# EAGLE design CH549_typeC_Power_Delivery (EAGLE 9.6.2)
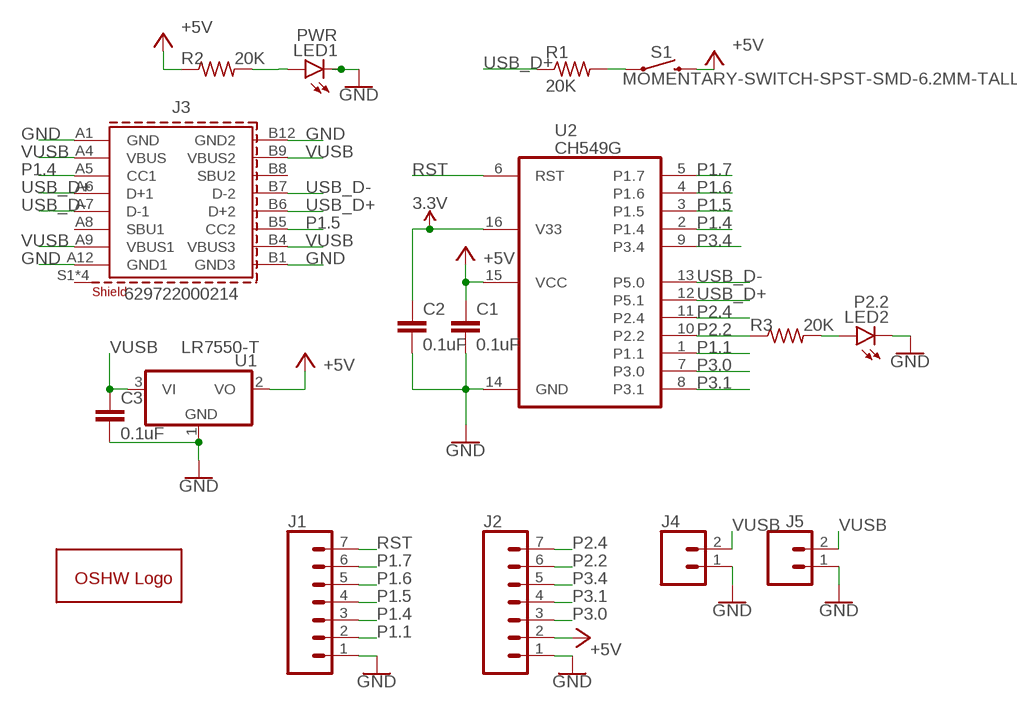
[diagram p0: schematic, sheet 1]

## Parts
C1  0.1uF  C-EUC0805K  [C0805K]
C2  0.1uF  C-EUC0805K  [C0805K]
C3  0.1uF  C-EUC0805K  [C0805K]
GOLD_ORB_SM1  OSHWLOGOLOGO8MM  [OSHW_8MM]
J1  CONN_07NO_SILK  [1X07_NO_SILK]
J2  CONN_07NO_SILK  [1X07_NO_SILK]
J3  629722000214  [629722000214]
J4  CONN_021X02_NO_SILK  [1X02_NO_SILK]
J5  CONN_021X02_NO_SILK  [1X02_NO_SILK]
LED1  PWR  GHI-BASICCOMPONENTS_LED-(INCH)-0805  [GHI-BASICCOMPONENTS_0805-LED]
LED2  P2.2  GHI-BASICCOMPONENTS_LED-(INCH)-0805  [GHI-BASICCOMPONENTS_0805-LED]
R1  20K  R-US_R0805  [R0805]
R2  20K  R-US_R0805  [R0805]
R3  20K  R-US_R0805  [R0805]
S1  MOMENTARY-SWITCH-SPST-SMD-6.2MM-TALL  [TACTILE_SWITCH_SMD_6.2MM_TALL]
U1  MCP1703CB  [SOT23]
U2  CH549G  MY_IC_CH549GSOP-16  [MY_IC_SO16]

## Nets
3.3V: C2.1 U2.16(V33)
+5V: C1.1 J2.2 R2.1 S1.B2 U1.2(VO) U2.15(VCC)
GND: C1.2 C2.2 C3.2 J1.1 J2.1 J3.A1(GND) J3.A12(GND1) J3.B1(GND3) J3.B12(GND2) J4.1 J5.1 LED1.K LED2.K U1.1(GND) U2.14(GND)
N$1: R1.2 S1.A2
N$2: LED2.A R3.2
N$3: LED1.A R2.2
P1.1: J1.2 U2.1(P1.1)
P1.4: J1.3 J3.A5(CC1) U2.2(P1.4)
P1.5: J1.4 J3.B5(CC2) U2.3(P1.5)
P1.6: J1.5 U2.4(P1.6)
P1.7: J1.6 U2.5(P1.7)
P2.2: J2.6 R3.1 U2.10(P2.2)
P2.4: J2.7 U2.11(P2.4)
P3.0: J2.3 U2.7(P3.0)
P3.1: J2.4 U2.8(P3.1)
P3.4: J2.5 U2.9(P3.4)
RST: J1.7 U2.6(RST)
USB_D+: J3.A6(D+1) J3.B6(D+2) R1.1 U2.12(P5.1)
USB_D-: J3.A7(D-1) J3.B7(D-2) U2.13(P5.0)
VUSB: C3.1 J3.A4(VBUS) J3.A9(VBUS1) J3.B4(VBUS3) J3.B9(VBUS2) J4.2 J5.2 U1.3(VI)
Unconnected: J3.A8(SBU1) J3.B8(SBU2) J3.S1(SHIELD) J3.S2(SHIELD) J3.S3(SHIELD) J3.S4(SHIELD)

## Library data of the parts
C1-C3 = rcl:C-EU: CAPACITOR, European symbol; LCSC: C16834; SPICEPREFIX: C
GOLD_ORB_SM1 = oshw:OSHWLOGO: The OSHW logo for PCB layout
J1 J2 = SparkFun-Connectors:CONN_07: Multi connection point. Often used as Generic Header-pin footprint for 0.1 inch spaced/style header connections On any of the 0.1 inch spaced packages, you can populate with these: Break Away Headers - Straight <https://www.sparkfun.com/products/116> (PRT-00116) Break Away Male Headers - Right Angle <https://www.sparkfun.com/products/553> (PRT-00553) Female Headers <https://www.sparkfun.com/products/115> (PRT-00115) Break Away Headers - Machine Pin <https://www.sparkfun.com/products/117> (PRT-00117) Break Away Female Headers - Swiss Machine Pin <https://www.sparkfun.com/products/743> (PRT-00743) For SCREWTERMINALS and SPRING TERMINALS visit here: Screw Terimnals on SparkFun.com <https://www.sparkfun.com/search/results?term=Screw+Terminals> (5mm/3.5mm/2.54mm spacing) This device is also useful as a general connection point to wire up your design to another part of your project. Our various solder wires solder well into these plated through hole pads. Hook-Up Wire - Assortment (Stranded, 22 AWG) <https://www.sparkfun.com/products/11375> (PRT-11375) Hook-Up Wire - Assortment (Solid Core, 22 AWG) <https://www.sparkfun.com/products/11367> (PRT-11367) View the entire wire category on our website here <https://www.sparkfun.com/categories/141> Special notes: Molex polarized connector foot print use with SKU : PRT-08231 with associated crimp pins and housings. 1MM SMD Version SKU: PRT-10208 NOTES ON THE VARIANTS LOCK and LOCK_LONGPADS... This footprint was designed to help hold the alignment of a through-hole component (i.e. 6-pin header) while soldering it into place. You may notice that each hole has been shifted either up or down by 0.005 of an inch from it's more standard position (which is a perfectly straight line). This slight alteration caused the pins (the squares in the middle) to touch the edges of the holes. Because they are alternating, it causes a "brace" to hold the component in place. 0.005 has proven to be the perfect amount of "off-center" position when using our standard breakaway headers. Although looks a little odd when you look at the bare footprint, once you have a header in there, the alteration is very hard to notice. Also,if you push a header all the way into place, it is covered up entirely on the bottom side.
J3 = Wurth_Connectors_WR-USB:629722000214: WR-COM USB 2.0 Type C Receptacle Horizontal SMT Kind Properties Durability 10 000 Mating cycles Gender Receptacle Type Horizontal General Information Operating Temperature -40 up to +85 °C Electrical Properties Working Voltage 20 V (DC) Withstanding Voltage 100 V (AC) Contact Resistance 40 mΩ Material Properties Insulator Material LCP Insulator Flammability Rating UL94 V-0 Insulator Color Black Contact Material Brass Contact Plating Gold over Nickel Contact Type Stamped Shielding Material Steel Shielding Plating Nickel (Ni) <https://www.we-online.com/components/media/o689297v209%20family-wr-com-629722000214.jpg> Details see: www.we-online.com/en/components/products/WR-COM_USB_20_TYPE_C_RECEPTACLE_HORIZONTAL_SMT <www.we-online.com/catalog/WR-COM_USB_20_TYPE_C_RECEPTACLE_HORIZONTAL_SMT/?utm_source=eagle_model&utm_medium=description_link&utm_campaign=eisos_eagle> Updated by Ella Wu 2023-05-30 2023 (C) Würth Elektronik; APPLICATION: USB 2.0; DATASHEET-URL: https://www.we-online.com/redexpert/spec/629722000214?ae; GERDER: Receptacle; INTERFACE-TYPE: Type C; IR: 5A; LCSC: C165948 C2765186; MOUNT: SMT; PACKAGING: Tape and Reel; PART-NUMBER: 629722000214; PINS: 16; TYPE: Horizontal; WORKING-VOLTAGE: 20V(AC)
J4 J5 = SparkFun-Connectors:CONN_02: Multi connection point. Often used as Generic Header-pin footprint for 0.1 inch spaced/style header connections On any of the 0.1 inch spaced packages, you can populate with these: Break Away Headers - Straight <https://www.sparkfun.com/products/116> (PRT-00116) Break Away Male Headers - Right Angle <https://www.sparkfun.com/products/553> (PRT-00553) Female Headers <https://www.sparkfun.com/products/115> (PRT-00115) Break Away Headers - Machine Pin <https://www.sparkfun.com/products/117> (PRT-00117) Break Away Female Headers - Swiss Machine Pin <https://www.sparkfun.com/products/743> (PRT-00743) For SCREWTERMINALS and SPRING TERMINALS visit here: Screw Terimnals on SparkFun.com <https://www.sparkfun.com/search/results?term=Screw+Terminals> (5mm/3.5mm/2.54mm spacing) This device is also useful as a general connection point to wire up your design to another part of your project. Our various solder wires solder well into these plated through hole pads. Hook-Up Wire - Assortment (Stranded, 22 AWG) <https://www.sparkfun.com/products/11375> (PRT-11375) Hook-Up Wire - Assortment (Solid Core, 22 AWG) <https://www.sparkfun.com/products/11367> (PRT-11367) View the entire wire category on our website here <https://www.sparkfun.com/categories/141> Special notes: Molex polarized connector foot print use with: PRT-08233 with associated crimp pins and housings. 2.54_SCREWTERM for use with PRT-10571. 3.5mm Screw Terminal footprints for PRT-08084 5mm Screw Terminal footprints for use with PRT-08432
LED1 LED2 = BeagleBone_Black_Wireless:GHI-BASICCOMPONENTS_LED-(INCH)-
R1-R3 = rcl:R-US_: RESISTOR, American symbol; SPICEPREFIX: R
S1 = SparkFun-Switches:MOMENTARY-SWITCH-SPST: Momentary Switch (Pushbutton) - SPST Normally-open (NO) SPST momentary switches (buttons, pushbuttons). Variants PTH-12MM - 12mm square, through-hole Momentary Pushbutton Switch - 12mm Square <https://www.sparkfun.com/products/9190> (COM-09190) PTH-6.0MM, PTH-6.0MM-KIT - 6.0mm square, through-hole Mini Pushbutton Switch <https://www.sparkfun.com/products/97> (COM-00097) KIT package intended for soldering kit's - only one side of pads' copper is exposed. PTH-RIGHT-ANGLE-KIT - Right-angle, through-hole Right Angle Tactile Button <https://www.sparkfun.com/products/10791> - Used on SparkFun BigTime Watch Kit <https://www.sparkfun.com/products/11734> SMD-12MM - 12mm square, surface-mount Tactile Button - SMD (12mm) <https://www.sparkfun.com/products/12993> (COM-12993) Used on SparkFun PicoBoard <https://www.sparkfun.com/products/11888> SMD-4.5MM - 4.5mm Square Trackball Switch Used on SparkFun Blackberry Trackballer Breakout <https://www.sparkfun.com/products/13169> SMD-4.6MMX2.8MM - 4.60mm x 2.80mm, surface mount Used on SparkFun SAMD21 Mini Breakout <https://www.sparkfun.com/products/13664> SMD-5.2MM, SMD-5.2-REDUNDANT - 5.2mm square, surface-mount Mini Pushbutton Switch - SMD <https://www.sparkfun.com/products/8720> (COM-08720) Used on Arduino Pro Mini <https://www.sparkfun.com/products/11114> REDUNDANT package connects both switch circuits together SMD-6.0X3.5MM - 6.0 x 3.5mm, surface mount Momentary Reset Switch SMD <https://www.sparkfun.com/products/8229> (COM-08229) SMD-6.2MM-TALL - 6.2mm square, surface mount Tactile Button - SMD (6mm) <https://www.sparkfun.com/products/12992> Used on SparkFun Digital Sandbox <https://www.sparkfun.com/products/12651> SMD-RIGHT-ANGLE - Right-angle, surface mount Used on SparkFun Block for Intel® Edison - Arduino <https://www.sparkfun.com/products/13036>; PROD_ID: SWCH-11966; SF_SKU: COM-12992
U1 = linear:MCP1703: 250 mA, 16V, Low Quiescent Current LDO Regulator Source: http://ww1.microchip.com/downloads/en/DeviceDoc/22049b.pdf; ACTUAL_PART: LR7550-T
U2 = myOwnLib:MY_IC_CH549G; LCSC: C111292

## Board
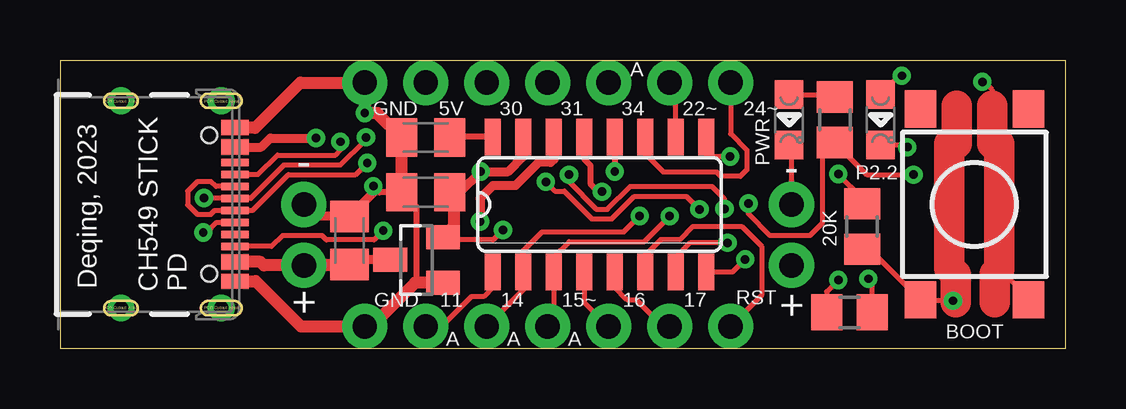
[diagram p1: board, top side]
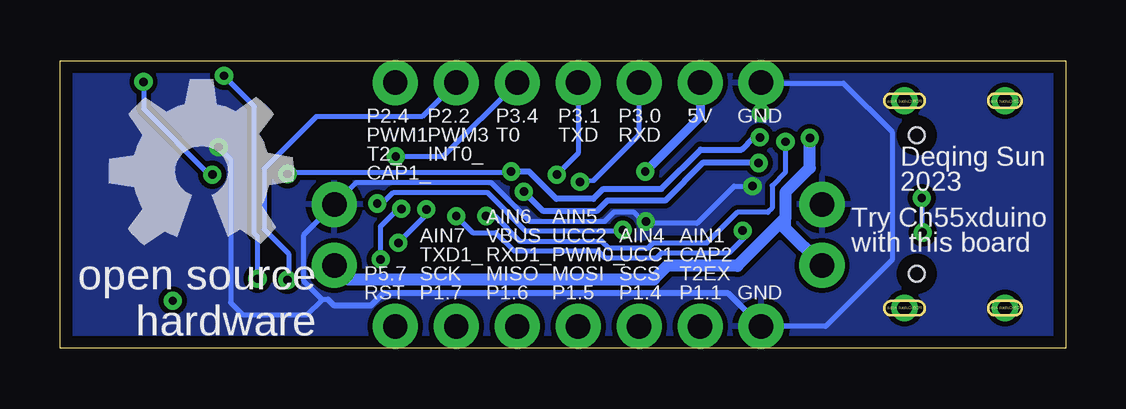
[diagram p2: board, bottom side, seen from below]

Size 41.91 x 11.99 mm. Coordinates in mm from the lower left corner, seen from the top.
Outline: 0,0 41.91,0 41.91,11.99 0,11.99 0,0
Copper layers (1*16): Top 0.035mm / dielectric 1.5mm / Bottom 0.035mm
Design rules "eagleRules10Mil *": minimum track width 8mil, minimum drill 0.3mm, track to track 8mil, track to pad 8mil, pad to pad 8mil, via to via 8mil, smd to smd 8mil, copper to edge 20mil, drill to drill 20mil, minimum pad ring 10mil, minimum via ring 8mil, stop-mask expansion 4mil, vias tented up to drill 14mil, thermal gap 10mil

### Footprints (pad centres in the part's own frame; a part is rotated, then mirrored left to right if it is on the bottom)
C0805K = smd 1.3 x 1.6: 1 -1,0; 2 1,0
1X07_NO_SILK = drill 1.016 pad 1.88: 1 0,0; 2 2.54,0; 3 5.08,0; 4 7.62,0; 5 10.16,0; 6 12.7,0; 7 15.24,0
629722000214 = smd 0.3 x 1.15: A1 -3.35,4.745; A4 -2.55,4.745; A5 -1.25,4.745; A6 -0.25,4.745; A7 0.25,4.745; A8 1.25,4.745; A9 2.55,4.745; A12 3.35,4.745; B1 3.05,4.745; B4 2.25,4.745; B5 1.75,4.745; B6 0.75,4.745; B7 -0.75,4.745; B8 -1.75,4.745; B9 -2.25,4.745; B12 -3.05,4.745 | drill 0.6 pad 1: S1 -4.32,4.18; S2 4.32,4.18; S3 -4.32,0; S4 4.32,0 | hole 0.65: -2.89,3.68; 2.89,3.68
1X02_NO_SILK = drill 1.016 pad 1.88: 1 0,0; 2 2.54,0
GHI-BASICCOMPONENTS_0805-LED = smd 1.2 x 1.2: A 0,1.05; K 0,-1.05
R0805 = smd 1.3 x 1.5: 1 -0.95,0; 2 0.95,0
TACTILE_SWITCH_SMD_6.2MM_TALL = smd 1.55 x 1.3: A1 -3.975,-2.25; A2 3.975,-2.25; B1 -3.975,2.25; B2 3.975,2.25
SOT23 = smd 1 x 1.4: 1 -0.95,-1.1; 2 0.95,-1.1; 3 0,1.1
MY_IC_SO16 = smd 0.66 x 1.524: 1 -4.445,-2.819; 2 -3.175,-2.819; 3 -1.905,-2.819; 4 -0.635,-2.819; 5 0.635,-2.819; 6 1.905,-2.819; 7 3.175,-2.819; 8 4.445,-2.819; 9 4.445,2.819; 10 3.175,2.819; 11 1.905,2.819; 12 0.635,2.819; 13 -0.635,2.819; 14 -1.905,2.819; 15 -3.175,2.819; 16 -4.445,2.819

### Placement (x,y rotation side)
C1  15.24,6.5 180 top
C2  15.24,8.79 180 top
C3  12.06,4.5 90 top
GOLD_ORB_SM1  36.04,7.37 0 bottom
J1  12.7,0.91 0 top
J2  12.7,11.07 0 top
J3  2.54,5.99 270 top
J4  10.16,5.99 270 top
J5  30.48,5.99 270 top
LED1  30.38,9.53 0 top
LED2  34.19,9.53 0 top
R1  33.43,5.08 270 top
R2  32.28,9.53 90 top
R3  32.89,1.5 0 top
S1  38.1,5.99 270 top
U1  14.86,3.68 90 top
U2  22.48,5.99 0 top

### Tracks (layer width: path | path; a pad name or v marks a point on that pad's centre or on a via)
3.3V
  Top 0.254: U2.16 16.27,8.81 C2.1
+5V  (via drill 0.35)
  Top 0.203: v18.46,4.93 18.05,4.52 16.07,4.52 U1.2 | S1.B2 40.35,2.14 39.14,3.3 39.09,3.35 39.09,3.25 38.94,3.1 | 39.14,8.53 38.84,8.53 | 38.84,10.11 38.84,10.77 38.43,11.18 v38.43,11.1 | v28.69,6.03 28.69,5.6 29.59,4.7 31.24,4.7 31.75,5.21 31.75,8.04 R2.1 33.62,7.24 v35.56,7.24
  Top 0.254: C1.1 16.66,6.5
  Top 0.305: 16.41,6.25 16.26,6.25 | 16,6.5 C1.1
  Top 0.381: 16.41,6.25 16.66,6.5 v17.53,7.37 18.67,7.37 19.3,8 U2.15
  Top 0.508: 16,6.5 16.26,6.25 16.41,6.1 16.41,5.08 U1.2
  Top 1.27: 39.14,8.53 39.14,3.3 | 38.84,10.11 38.84,8.53 | 38.94,3.1 38.94,1.93
  Bottom 0.203: v18.46,4.93 18.52,4.88 22.5,4.88 24.11,6.5 28.02,6.5 28.69,5.83 v28.69,6.03 | v38.43,11.1 38.43,9.98 35.69,7.24 v35.56,7.24
  Bottom 0.381: J2.2 15.24,9.65 v17.53,7.37
GND  (via drill 0.35)
  Top 0.203: 7.16,9.24 7.18,9.24 J3.A1 J3.B12 | 7.44,2.8 J3.A12 J3.B1 | J5.1 30.48,8.37 LED1.K | LED2.K 35.21,8.47 v35.31,8.38
  Top 0.254: v13.06,6.76 13.31,6.5 C1.2 14.86,5.88 14.86,2.79 14.8,2.73
  Top 0.381: v17.5,5.28 17.5,6.25 18.03,6.78 18.97,6.78 19.94,7.75 20.45,7.75 20.57,7.87 U2.14 | J4.1 10.66,5.5 C3.2 13.06,6.49 v13.06,6.76
  Top 0.508: C1.2 C2.2 13.22,9.8 v12.7,9.8 J2.1 10.01,11.07 8.13,9.19 7.21,9.19 7.16,9.24 | U1.1 14.8,2.73 12.98,0.91 J1.1 10.03,0.91 8.15,2.8 7.44,2.8
  Bottom 0.203: 12.7,11.05 9.27,11.05 7.24,9.02 7.24,3.68 10.01,0.91 J1.1 | v13.06,6.76 13.82,6.76 15.37,5.21 17.42,5.21 v17.5,5.28 17.6,5.28 18.01,5.69 18.82,5.69 19.23,5.28 22.33,5.28 23.95,6.9 29.57,6.9 J5.1 31.75,4.72 31.75,2.79 30.99,2.03 | 30.73,2.03 30.99,2.03 | v35.31,8.38 34.8,7.87 34.8,1.91 34.29,1.4 31.62,1.4 30.99,2.03
  Bottom 0.254: J2.1 12.7,11.05 v12.7,9.8 | J1.1 14.07,2.29 28.45,2.29 28.96,1.78 30.48,1.78 30.73,2.03
  pour Bottom: 0,0 41.91,0 41.91,11.99 0,11.99
N$1  (via drill 0.35)
  Top 0.203: 37.06,8.53 37.36,8.53 | 37.06,3.34 37.31,3.08 | 37.31,1.93 37.26,1.98 v37.21,1.98 35.89,1.98 S1.A2 33.74,4.13 R1.2
  Top 1.27: 37.06,8.53 37.06,3.34 | 37.36,8.53 37.36,10.11 | 37.31,1.93 37.31,3.08
N$2  (via drill 0.35)
  Top 0.203: R3.2 33.84,2.74 v33.68,2.9 | LED2.A 34.95,11.34 34.95,11.36 v35.08,11.36
  Bottom 0.203: v33.68,2.9 33.68,4.66 33.81,4.79 33.81,10.09 v35.08,11.36
N$3
  Top 0.203: LED1.A 32.18,10.57 R2.2
P1.1
  Top 0.203: U2.1 18.03,2.54 17.65,2.16 17.14,2.16 15.9,0.91 J1.2
P1.4  (via drill 0.35)
  Top 0.203: J1.3 19.3,2.44 U2.2 19.3,4.06 20.09,4.85 23.49,4.85 v24.15,5.51 | J3.A5 8.25,7.24 9.05,8.05 11.48,8.05 11.68,8.26 v11.68,8.61
  Bottom 0.203: v24.15,5.51 23.8,5.51 22.76,4.47 19.33,4.47 19.05,4.19 17.4,4.19 17.19,4.4 14.96,4.4 13.69,5.67 12.42,5.67 12.24,5.84 12.24,6.78 11.68,7.34 v11.68,8.61
P1.5  (via drill 0.35)
  Top 0.203: J1.4 20.57,1.17 U2.3 20.57,3.81 21.21,4.45 24.34,4.45 v25.4,5.51 | v13.47,4.9 13.09,4.52 11.1,4.52 10.92,4.7 9.27,4.7 8.82,4.24 J3.B5
  Bottom 0.203: v25.4,5.51 24.72,4.83 23.75,4.83 22.99,4.06 19.5,4.06 19.22,3.79 17.04,3.79 16.84,3.99 14.03,3.99 13.39,4.63 13.39,4.82 v13.47,4.9
P1.6
  Top 0.203: U2.4 21.84,1.93 J1.5
P1.7
  Top 0.203: U2.5 23.11,2.54 23.62,2.03 24,2.03 24.94,1.09 25.22,1.09 J1.6
P2.2  (via drill 0.35)
  Top 0.203: U2.10 25.65,10.82 J2.6 | v32.43,2.85 31.94,2.36 R3.1
  Bottom 0.203: J2.6 26.82,9.65 31.24,9.65 33.4,7.49 33.4,4.95 32.38,3.94 32.38,2.92 32.43,2.87 v32.43,2.85
P2.4
  Top 0.203: U2.11 24.38,8.1 25.13,7.35 27.34,7.35 27.53,7.16 28.35,7.16 28.62,7.43 28.62,8.26 27.94,8.94 J2.7
P3.0  (via drill 0.35)
  Top 0.203: v20.24,6.93 20.62,6.55 21.02,6.55 22.18,5.38 22.98,5.38 23.93,6.33 26.1,6.33 v26.64,5.79 | U2.7 25.65,3.79 26.29,4.42 27.79,4.42 v27.81,4.39
  Bottom 0.203: v20.24,6.93 19.68,6.99 17.78,8.89 J2.3 | v26.64,5.79 26.64,5.56 v27.81,4.39
P3.1  (via drill 0.35)
  Top 0.203: v21.21,7.24 21.21,6.93 22.35,5.79 22.81,5.79 23.76,6.74 27.17,6.74 27.69,6.22 v27.69,5.81 | v28.55,3.71 28.02,3.17 U2.8
  Bottom 0.203: v21.21,7.24 20.32,8.13 J2.4 | v27.69,5.81 27.81,5.81 28.55,5.08 v28.55,3.71
P3.4  (via drill 0.35)
  Top 0.203: U2.9 26.9,8.79 26.9,8.13 27.03,7.99 v27.92,7.99
  Bottom 0.203: J2.5 25.93,8 v27.91,8 v27.92,7.99
RST
  Top 0.203: U2.6 24.38,3.89 25.03,4.53 25.82,4.53 26.38,5.08 28.4,5.08 29.23,4.25 29.23,2.21 J1.7
USB_D+  (via drill 0.35)
  Top 0.203: v6,6.27 6.02,6.24 J3.A6 7.95,6.24 9.35,7.64 11.69,7.64 12.69,8.65 12.65,8.69 v12.75,8.79 | v5.97,4.83 6.1,4.83 6.51,5.24 J3.B6 | v32.43,7.26 33.43,6.27 R1.1
  Top 0.254: U2.12 v23.11,7.37
  Bottom 0.203: v23.11,7.37 23.11,7.31 32.38,7.31 v32.43,7.26 | v6,6.27 6,4.86 v5.97,4.83
  Bottom 0.254: v23.11,7.37 22.37,7.37 21.22,6.22 19.68,6.22 19.27,6.64 16.85,6.64 15.21,8.28 13.51,8.28 13.01,8.79 v12.75,8.79
USB_D-  (via drill 0.35)
  Top 0.203: J3.B7 6.49,6.74 6.29,6.95 5.72,6.95 5.32,6.55 5.32,5.98 5.72,5.58 6.29,5.58 6.45,5.74 J3.A7 8.02,5.74 9.52,7.24 12.32,7.24 v12.8,7.72
  Top 0.254: U2.13 21.84,7.87 22.1,7.62 22.1,6.86 22.43,6.53 v22.58,6.53
  Bottom 0.254: v22.58,6.53 21.77,5.71 19.55,5.71 19.11,6.15 16.7,6.15 15.1,7.75 12.83,7.75 v12.8,7.72
VUSB  (via drill 0.35)
  Top 0.203: 7.42,8.38 J3.B9 J3.A4 | J3.A9 J3.B4 7.4,3.63
  Top 0.381: 7.42,8.38 8.38,8.38 8.76,8.76 v10.67,8.76 | U1.3 12.25,3.68 C3.1 | 7.4,3.63 7.33,3.7 7.29,3.7
  Top 0.508: C3.1 12.02,3.45 J4.2 8.5,3.45 8.35,3.61 7.42,3.61 7.4,3.63
  Bottom 0.508: 11.68,5.44 11.68,6.5 10.67,7.51 v10.67,8.76 | J5.2 29.9,2.87 17.17,2.87 16.61,3.43 13.69,3.43 11.68,5.44 | J4.2 11.68,4.98 11.68,5.44

### Text on the board
tNames: A | GND | 5V | 30 | 31 | 34 | 22~ | 24~ | Deqing, 2023 | PWR | - | - | P2.2 | 20K | CH549 STICK / PD | GND | 11 | 14 | 15~ | 16 | 17 | RST | + | + | A | A | A | BOOT
bNames: GND | 5V | P3.0 / RXD | P3.1 / TXD | P3.4 / T0 | P2.2 / PWM3 / INT0_ | P2.4 / PWM1 / T2_ / CAP1_ | Deqing Sun / 2023 | Try Ch55xduino / with this board | GND | AIN1 / CAP2 / T2EX / P1.1 | AIN4 / UCC1 / SCS / P1.4 | AIN5 / UCC2 / PWM0_ / MOSI / P1.5 | AIN6 / VBUS / RXD1_ / MISO / P1.6 | AIN7 / TXD1_ / SCK / P1.7 | P5.7 / RST